# Altium schematic sheet ADS7952.SchDoc
size A4
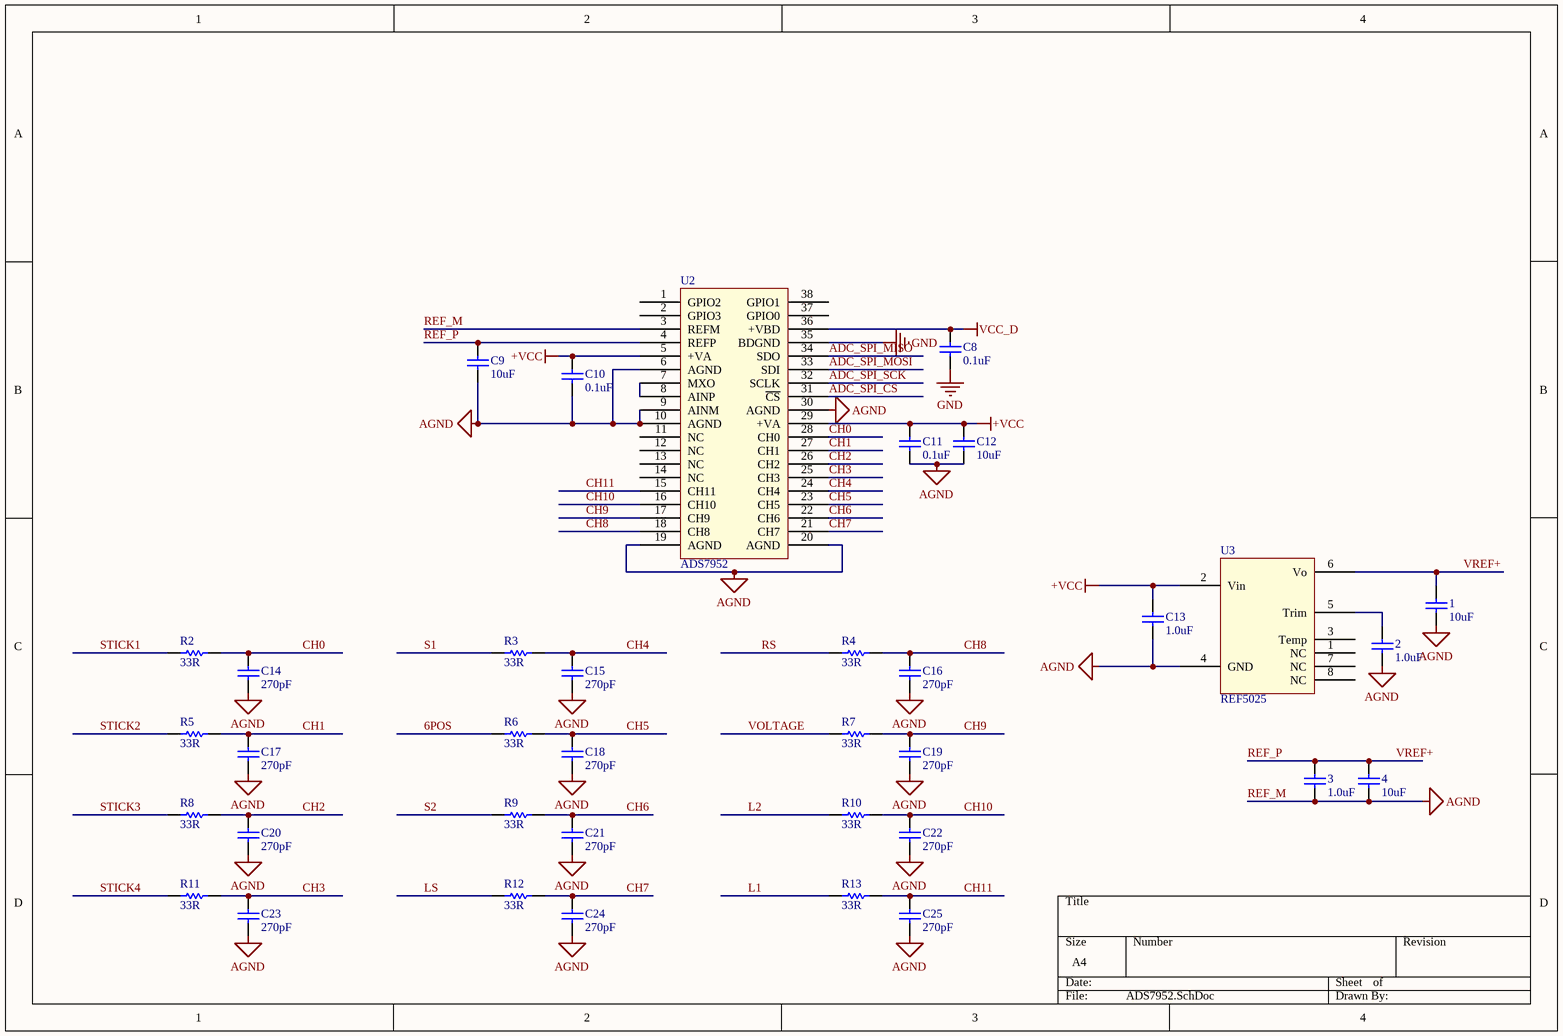
[diagram p0: ADS7952.SchDoc]

## Parts
1  10uF  [0603C]
2  1.0uF  [0603C]
3  1.0uF  [0603C]
4  10uF  [0603C]
C8  0.1uF  [0603C]
C9  10uF  [0603C]
C10  0.1uF  [0603C]
C11  0.1uF  [0603C]
C12  10uF  [0603C]
C13  1.0uF  [0603C]
C14  270pF  [0603C]
C15  270pF  [0603C]
C16  270pF  [0603C]
C17  270pF  [0603C]
C18  270pF  [0603C]
C19  270pF  [0603C]
C20  270pF  [0603C]
C21  270pF  [0603C]
C22  270pF  [0603C]
C23  270pF  [0603C]
C24  270pF  [0603C]
C25  270pF  [0603C]
R2  33R  [0603R]
R3  33R  [0603R]
R4  33R  [0603R]
R5  33R  [0603R]
R6  33R  [0603R]
R7  33R  [0603R]
R8  33R  [0603R]
R9  33R  [0603R]
R10  33R  [0603R]
R11  33R  [0603R]
R12  33R  [0603R]
R13  33R  [0603R]
U2  ADS7952
U3  REF5025

## Nets
+VCC: C10.2 C11.2 C12.2 C13.2 U2.5(+VA) U2.29(+VA) U3.2(Vin)
GND: C8.1 U2.35(BDGND)
REF_M: 1.1 2.1 3.1 4.1 C9.1 C10.1 C11.1 C12.1 C13.1 C14.1 C15.1 C16.1 C17.1 C18.1 C19.1 C20.1 C21.1 C22.1 C23.1 C24.1 C25.1 U2.3(REFM) U2.6(AGND) U2.9(AINM) U2.10(AGND) U2.19(AGND) U2.20(AGND) U2.30(AGND) U3.4(GND)  [also labelled AGND]
VCC_D: C8.2 U2.36(+VBD)
6POS: R6.1
ADC_SPI_CS: U2.31(~{CS})
ADC_SPI_MISO: U2.34(SDO)
ADC_SPI_MOSI: U2.33(SDI)
ADC_SPI_SCK: U2.32(SCLK)
CH0: C14.2 R2.2 U2.28(CH0)
CH1: C17.2 R5.2 U2.27(CH1)
CH2: C20.2 R8.2 U2.26(CH2)
CH3: C23.2 R11.2 U2.25(CH3)
CH4: C15.2 R3.2 U2.24(CH4)
CH5: C18.2 R6.2 U2.23(CH5)
CH6: C21.2 R9.2 U2.22(CH6)
CH7: C24.2 R12.2 U2.21(CH7)
CH8: C16.2 R4.2 U2.18(CH8)
CH9: C19.2 R7.2 U2.17(CH9)
CH10: C22.2 R10.2 U2.16(CH10)
CH11: C25.2 R13.2 U2.15(CH11)
L1: R13.1
L2: R10.1
LS: R12.1
REF_P: 1.2 3.2 4.2 C9.2 U2.4(REFP) U3.6(Vo)  [also labelled VREF+]
RS: R4.1
S1: R3.1
S2: R9.1
STICK1: R2.1
STICK2: R5.1
STICK3: R8.1
STICK4: R11.1
VOLTAGE: R7.1
Net2_2: 2.2 U3.5(Trim)
NetU2_7: U2.7(MXO) U2.8(AINP)

Not connected (* = marked no-connect by the designer): U2 1(GPIO2) 2(GPIO3) 11(NC) 12(NC) 13(NC) 14(NC) 37(GPIO0) 38(GPIO1); U3 1(NC) 3(Temp) 7(NC) 8(NC)

## Library data of the parts
1-4 C8-C25 = CAP-0603: 电容
R2-R13 = RES-0603: Resistance
U2 = ADS7952: ADC采集芯片
U3 = REF5025: 基准源芯片